# EAGLE design X16-ESC-Controller (EAGLE 9.6.2)
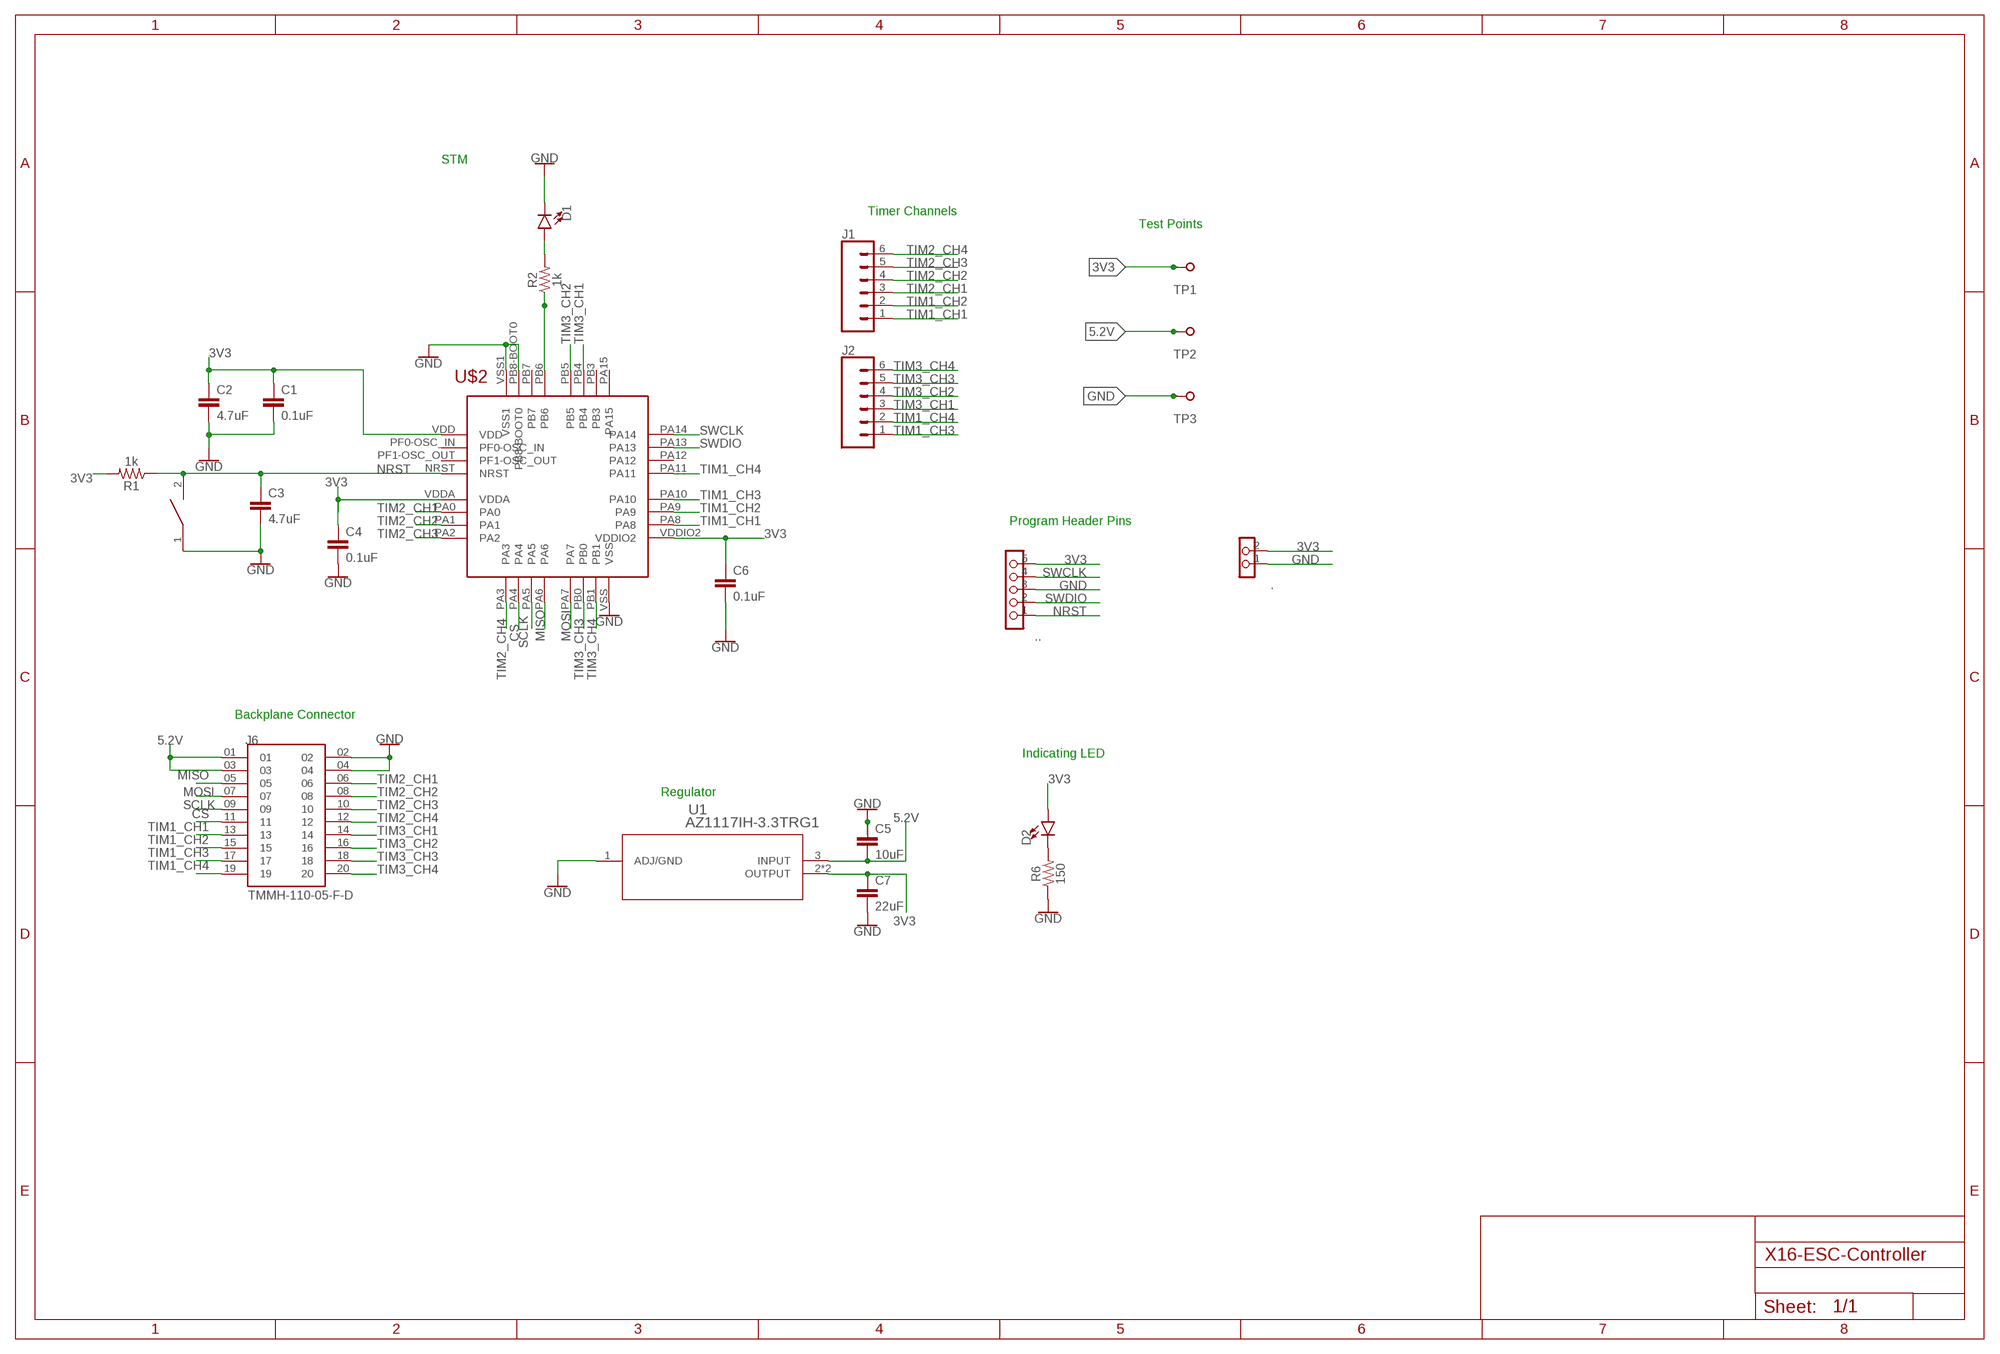
[diagram p0: schematic, sheet 1]

## Parts
.  TEST_PIN-1X2  [1X02]
..  TEST_PIN-1X5  [1X05]
C1  0.1uF  4.7PF-0603-50V-5%  [0603]
C2  4.7uF  4.7PF-0603-50V-5%  [0603]
C3  4.7uF  4.7PF-0603-50V-5%  [0603]
C4  0.1uF  4.7PF-0603-50V-5%  [0603]
C5  10uF  4.7PF-0603-50V-5%  [0603]
C6  0.1uF  4.7PF-0603-50V-5%  [0603]
C7  22uF  4.7PF-0603-50V-5%  [0603]
D1  Green  LED-GREEN0805-PG  [LED-0805]
D2  Green  LED-GREEN0805-PG  [LED-0805]
J1  CONN_06NO_SILK_NO_POP  [1X06_NO_SILK]
J2  CONN_06NO_SILK_NO_POP  [1X06_NO_SILK]
J6  TMMH-110-05-F-D  [SAMTEC_TMMH-110-05-F-D]
R1  1k  2.55KOHM-0603-1/10W-1%  [0603]
R2  1k  2.55KOHM-0603-1/10W-1%  [0603]
R6  150  2.55KOHM-0603-1/10W-1%  [0603]
TP1  TESTPOINT_5.04MM  [TESTPOINT_5.04MM]
TP2  TESTPOINT_5.04MM  [TESTPOINT_5.04MM]
TP3  TESTPOINT_5.04MM  [TESTPOINT_5.04MM]
U1  AZ1117IH-3.3TRG1  [SOT223_AZ1117I_6P5X3P5_DIO]
U$2  IC_STM32F042K6T6  [STM32F042K6T6]
U$3  SWITCH_DISCRETECOMPONENTS  [DISCRETECOMPONENTS_SW_2512]

## Nets
3V3: ..2 ...5 C1.1 C2.1 C4.1 C6.1 C7.1 D2.A R1.2 TP1.TP U1.2(OUTPUT) U1.4(OUTPUT) U$2.VDD U$2.VDDA U$2.VDDIO2
5.2V: C5.2 J6.01 J6.03 TP2.TP U1.3(INPUT)
CS: J6.11 U$2.PA4
GND: ..1 ...3 C1.2 C2.2 C3.2 C4.2 C5.1 C6.2 C7.2 D1.C J6.02 J6.04 R6.1 TP3.TP U1.1(ADJ/GND) U$2.PB8-BOOT0 U$2.VSS U$2.VSS1 U$3.1
MISO: J6.05 U$2.PA6
MOSI: J6.07 U$2.PA7
N$1: D2.C R6.2
N$3: R2.1 U$2.PB6
N$7: D1.A R2.2
NRST: ...1 C3.1 R1.1 U$2.NRST U$3.2
SCLK: J6.09 U$2.PA5
SWCLK: ...4 U$2.PA14
SWDIO: ...2 U$2.PA13
TIM1_CH1: J1.1 J6.13 U$2.PA8
TIM1_CH2: J1.2 J6.15 U$2.PA9
TIM1_CH3: J2.1 J6.17 U$2.PA10
TIM1_CH4: J2.2 J6.19 U$2.PA11
TIM2_CH1: J1.3 J6.06 U$2.PA0
TIM2_CH2: J1.4 J6.08 U$2.PA1
TIM2_CH3: J1.5 J6.10 U$2.PA2
TIM2_CH4: J1.6 J6.12 U$2.PA3
TIM3_CH1: J2.3 J6.14 U$2.PB4
TIM3_CH2: J2.4 J6.16 U$2.PB5
TIM3_CH3: J2.5 J6.18 U$2.PB0
TIM3_CH4: J2.6 J6.20 U$2.PB1
Unconnected: U$2.PA12 U$2.PA15 U$2.PB3 U$2.PB7 U$2.PF0-OSC_IN U$2.PF1-OSC_OUT

## Notes on the sheet
- STM
- Timer Channels
- Test Points
- Program Header Pins
- Backplane Connector
- Indicating LED
- Regulator

## Library data of the parts
. = X16-ExtraComponents:TEST_PIN-1X2: PIN HEADER
.. = X16-ExtraComponents:TEST_PIN-1X5: PIN HEADER
C1-C7 = SparkFun-Capacitors:4.7PF: 4.7pF ceramic capacitors A capacitor is a passive two-terminal electrical component used to store electrical energy temporarily in an electric field.; PROD_ID: CAP-07880; VALUE: 4.7pF
D1 D2 = SparkFun-LED:LED-GREEN: Green SMD LED Used in manufacturing of various products at SparkFun Packages: 0603 - SMD 0603 package [Product Link] <http://www.futureelectronics.com/en/technologies/semiconductors/optoelectronics/leds/Pages/9894312-LTST-C190GKT.aspx?CrossPart=HSMG-C190&IM=0> LilyPad 1206 - SMD1206 LilyPad package [Product Link] <http://www.futureelectronics.com/en/Technologies/Product.aspx?ProductID=IN150NGHARVATEKCORPORATION2049943&IM=0> 1206 - SMD1206 package [Product Link] <http://www.futureelectronics.com/en/technologies/semiconductors/optoelectronics/leds/Pages/8315665-LTST-C150KGKT.aspx?IM=0> 1206 Bottom Mount -SMD 1206 Bottom Mount [Product Link] <http://www.digikey.com/product-detail/en/lite-on-inc/LTST-C230KGKT/160-1456-1-ND/386854> SparkFun Products: Pro Mini 328 -5V <https://www.sparkfun.com/products/821> RedBoard <https://www.sparkfun.com/products/12757> MP3 Trigger <https://www.sparkfun.com/products/13720> Makey Makey <https://www.sparkfun.com/products/11076>
J1 J2 = SparkFun-Connectors:CONN_06: Multi connection point. Often used as Generic Header-pin footprint for 0.1 inch spaced/style header connections On any of the 0.1 inch spaced packages, you can populate with these: Break Away Headers - Straight <https://www.sparkfun.com/products/116> (PRT-00116) Break Away Male Headers - Right Angle <https://www.sparkfun.com/products/553> (PRT-00553) Female Headers <https://www.sparkfun.com/products/115> (PRT-00115) Break Away Headers - Machine Pin <https://www.sparkfun.com/products/117> (PRT-00117) Break Away Female Headers - Swiss Machine Pin <https://www.sparkfun.com/products/743> (PRT-00743) Arduino Stackable Header - 6 Pin <https://www.sparkfun.com/products/9280> (PRT-09280) Screw Terminals 2.54mm Pitch (6-Pin) <https://www.sparkfun.com/products/16499> (PRT-16499) For SCREWTERMINALS and SPRING TERMINALS visit here: Screw Terimnals on SparkFun.com <https://www.sparkfun.com/search/results?term=Screw+Terminals> (5mm/3.5mm/2.54mm spacing) This device is also useful as a general connection point to wire up your design to another part of your project. Our various solder wires solder well into these plated through hole pads. Hook-Up Wire - Assortment (Stranded, 22 AWG) <https://www.sparkfun.com/products/11375> (PRT-11375) Hook-Up Wire - Assortment (Solid Core, 22 AWG) <https://www.sparkfun.com/products/11367> (PRT-11367) View the entire wire category on our website here <https://www.sparkfun.com/categories/141>
J6 = TMMH-110-05-F-D:TMMH-110-05-F-D; MANUFACTURER: Samtec; PARTREV: R; STANDARD: Manufacturer Recommendations
R1 R2 R6 = SparkFun-Resistors:2.55KOHM: 2.55kΩ resistor A resistor is a passive two-terminal electrical component that implements electrical resistance as a circuit element. Resistors act to reduce current flow, and, at the same time, act to lower voltage levels within circuits. - Wikipedia; PROD_ID: RES-11227; VALUE: 2.55k
TP1-TP3 = X16-ExtraComponents:TESTPOINT_5.04MM: TEST PIN
U1 = X16-ESC-Controller:AZ1117IH-3.3TRG1; COPYRIGHT: Copyright (C) 2023 Ultra Librarian. All rights reserved.; MANUFACTURER_PART_NUMBER: AZ1117IH-3.3TRG1; MFR_NAME: Diodes Inc
U$2 = X16-ESC-Controller:IC_STM32F042K6T6
U$3 = X16-ESC-Controller:SWITCH_DISCRETECOMPONENTS: TE Connectivity FSM2JMTR Switch

## Board
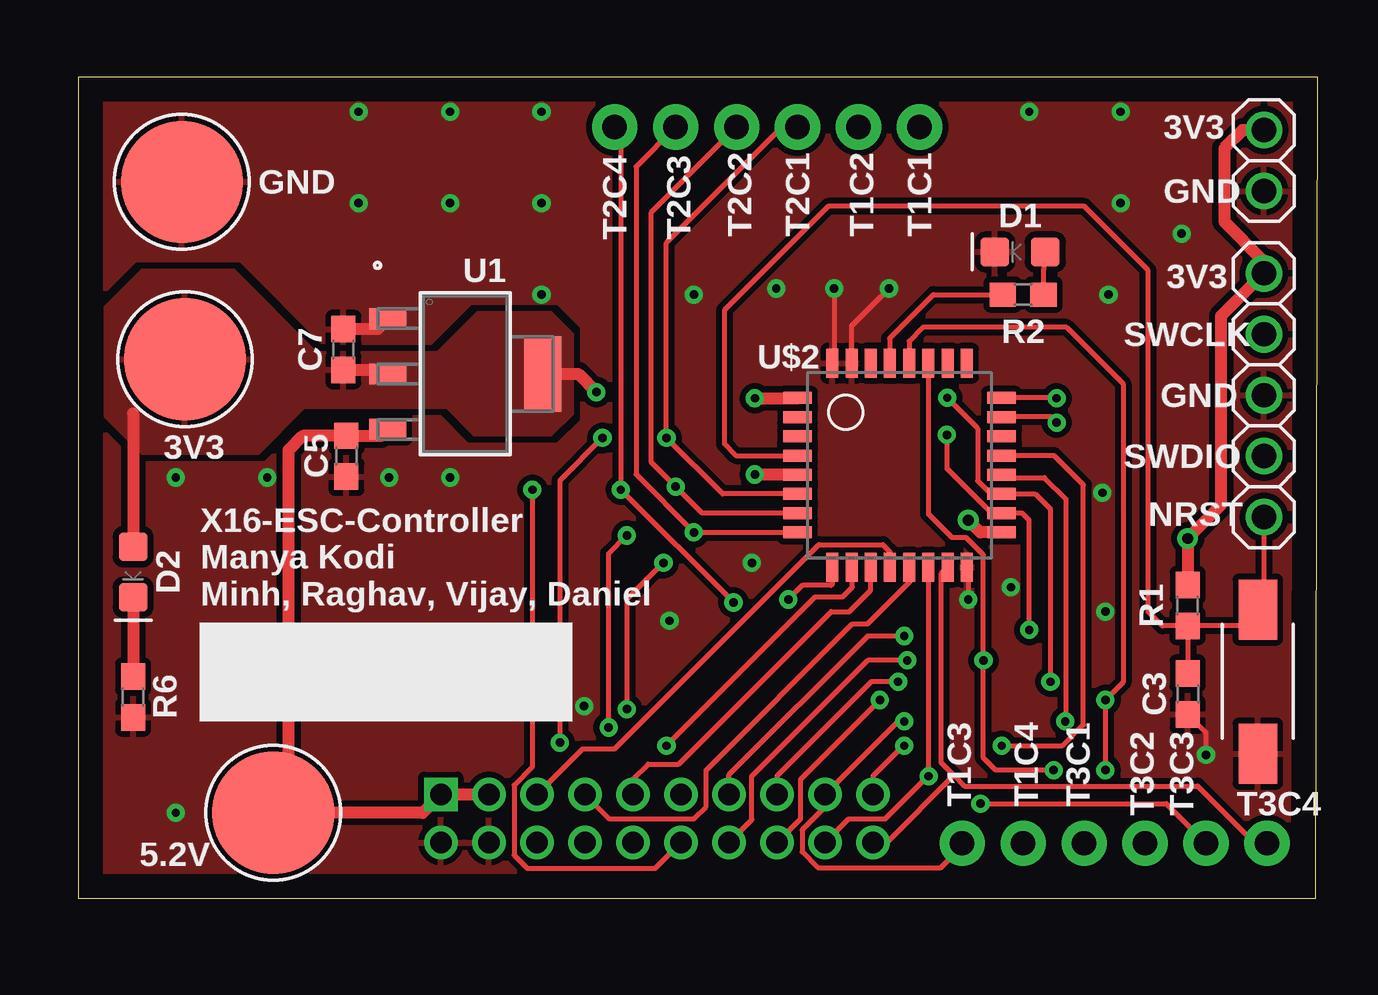
[diagram p1: board, top side]
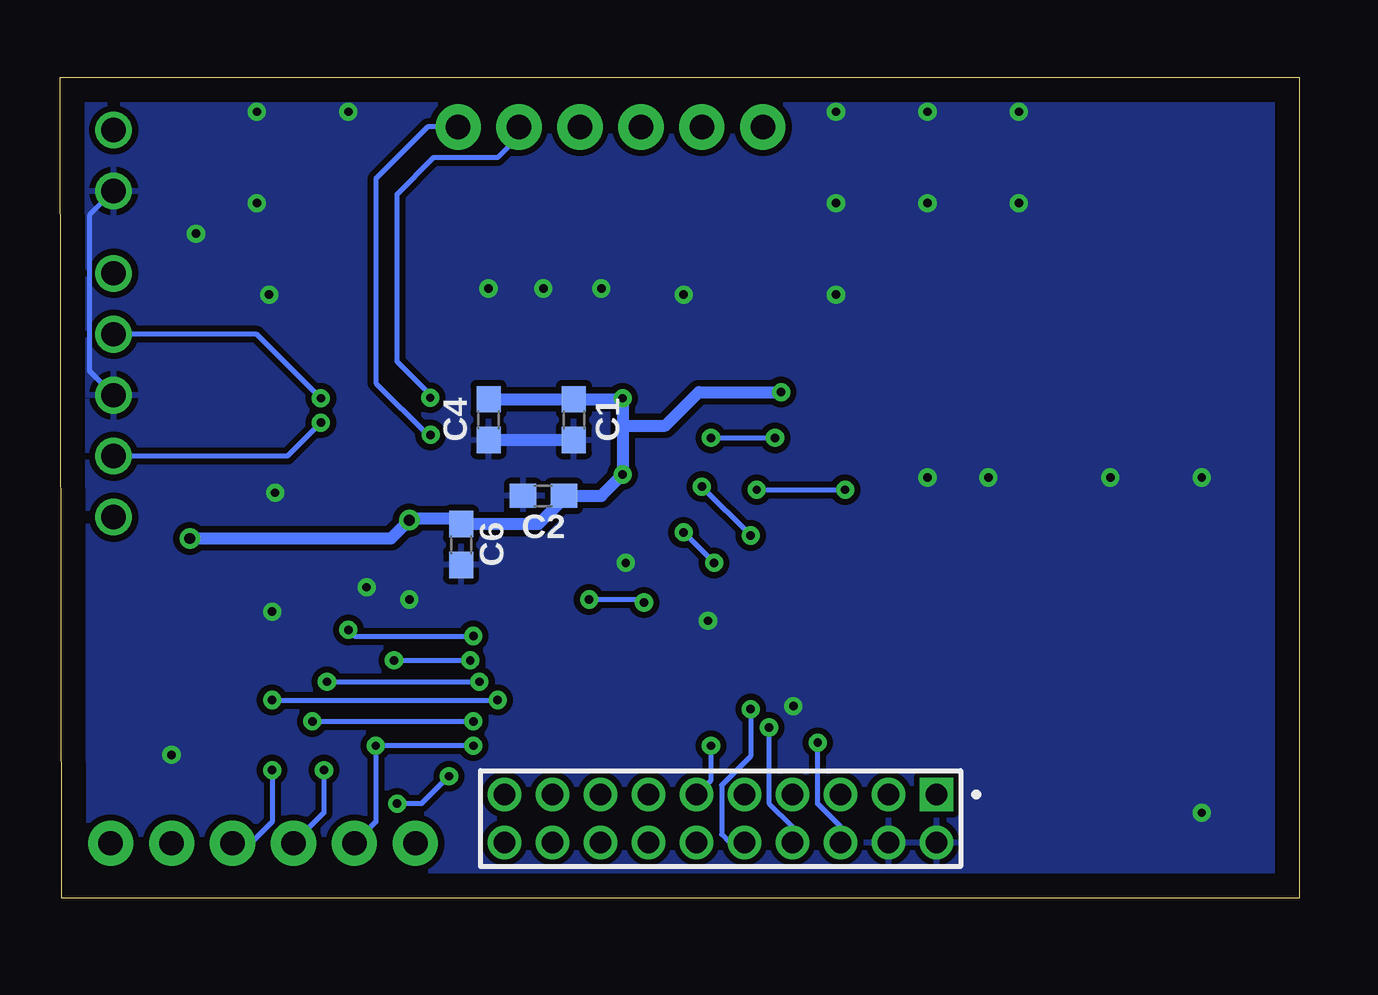
[diagram p2: board, bottom side, seen from below]

Size 51.64 x 34.21 mm. Coordinates in mm from the lower left corner, seen from the top.
Outline: 0,0 51.56,0 51.64,34.21 0,34.21 0,0
Copper layers (1*16): Top 0.035mm / dielectric 1.5mm / Bottom 0.035mm
Design rules "477": minimum track width 6mil, minimum drill 0.35mm, track to track 6mil, track to pad 6mil, pad to pad 6mil, via to via 6mil, smd to smd 6mil, copper to edge 40mil, drill to drill 6mil, minimum pad ring 10mil, minimum via ring 8mil, stop-mask expansion 4mil, vias tented up to drill 0mil, thermal gap 10mil

### Footprints (pad centres in the part's own frame; a part is rotated, then mirrored left to right if it is on the bottom)
1X02 = drill 1.016: 1 -1.27,0; 2 1.27,0
1X05 = drill 1.016: 1 -5.08,0; 2 -2.54,0; 3 0,0; 4 2.54,0; 5 5.08,0
0603 = smd 1.1 x 1: 1 -0.85,0; 2 0.85,0
LED-0805 = smd 1.2 x 1.2: A -1.05,0; C 1.05,0
1X06_NO_SILK = drill 1.016 pad 1.88: 1 0,0; 2 2.54,0; 3 5.08,0; 4 7.62,0; 5 10.16,0; 6 12.7,0
SAMTEC_TMMH-110-05-F-D = drill 0.889 pad 1.239 square: 01 0,0 | drill 0.889 pad 1.239: 02 0,2; 03 2,0; 04 2,2; 05 4,0; 06 4,2; 07 6,0; 08 6,2; 09 8,0; 10 8,2; 11 10,0; 12 10,2; 13 12,0; 14 12,2; 15 14,0; 16 14,2; 17 16,0; 18 16,2; 19 18,0; 20 18,2
TESTPOINT_5.04MM = smd 5.08 x 5.08: TP 0,0
SOT223_AZ1117I_6P5X3P5_DIO = smd 0.864 x 1.549: 1 -2.3,-3.226; 2 0,-3.226; 3 2.3,-3.226 | smd 3.15 x 1.549: 4 0,3.226
STM32F042K6T6 = smd 1.2 x 0.5: NRST 0,3.2; PA0 0,1.6; PA1 0,0.8; PA2 0,0; PA8 8.5,0.8; PA9 8.5,1.6; PA10 8.5,2.4; PA11 8.5,3.2; PA12 8.5,4; PA13 8.5,4.8; PA14 8.5,5.6; PF0-OSC_IN 0,4.8; PF1-OSC_OUT 0,4; VDD 0,5.6; VDDA 0,2.4; VDDIO2 8.5,0 | smd 0.5 x 1.2: PA3 1.45,-1.45; PA4 2.25,-1.45; PA5 3.05,-1.45; PA6 3.85,-1.45; PA7 4.65,-1.45; PA15 7.05,7.05; PB0 5.45,-1.45; PB1 6.25,-1.45; PB3 6.25,7.05; PB4 5.45,7.05; PB5 4.65,7.05; PB6 3.85,7.05; PB7 3.05,7.05; PB8-BOOT0 2.25,7.05; VSS 7.05,-1.45; VSS1 1.45,7.05
DISCRETECOMPONENTS_SW_2512 = smd 2.5 x 1.6: 1 -3,0; 2 3,0

### Placement (x,y rotation side)
.  49.4,30.73 90 top
..  49.4,20.95 90 top
C1  30.23,19.94 270 bottom
C2  31.5,16.76 180 bottom
C3  46.23,8.51 270 top
C4  33.78,19.94 270 bottom
C5  11.18,18.41 90 top
C6  34.92,14.73 270 bottom
C7  11.05,22.86 90 top
D1  39.24,26.92 180 top
D2  2.29,13.59 270 top
J1  35.05,32.13 180 top
J2  36.83,2.29 0 top
J6  15.11,4.32 180 bottom
R1  46.23,12.19 90 top
R2  39.37,25.15 0 top
R6  2.29,8.38 90 top
TP1  4.45,22.45 0 top
TP2  8.13,3.56 0 top
TP3  4.32,29.84 0 top
U1  16.13,21.84 270 top
U$2  29.97,15.24 0 top
U$3  49.15,9.02 90 top

### Tracks (layer width: path | path; a pad name or v marks a point on that pad's centre or on a via)
3V3  (via drill 0.35, 0.45)
  Top 0.508: U$2.VDD 29.96,20.83 v28.19,20.83 | U$2.VDDA 29.96,17.65 v28.19,17.65 | U$2.VDDIO2 37.59,15.24 v37.08,15.75 | R1.2 v46.23,14.99 47.62,16.38 47.62,24.26 ...5 49.4,26.54 47.75,28.19 47.75,31.24 48.51,32 ..2 | R1.2 | C7.1 12.74,22.01 U1.2 | U1.4 20.83,21.84 v21.59,21.08 | 2.29,20.19 D2.A
  Bottom 0.152: 28.23,20.79 v28.19,20.83 | C2.1 30.65,16.64
  Bottom 0.508: C4.1 C1.1 28.23,20.79 | v46.23,14.99 37.85,14.99 v37.08,15.75 37,15.84 35.18,15.84 C6.1 31.7,15.58 30.65,16.64 | C2.1 29.08,16.76 v28.19,17.65 28.19,19.68 | v28.19,20.83 28.19,19.68 | 28.19,19.68 26.42,19.68 25.02,21.08 v21.59,21.08
  pour Top (isolate 0.203): 9.91,22.73 14.99,22.73 16.64,24.38 19.69,24.38 20.57,23.49 20.57,20.19 19.69,19.3 16.51,19.3 15.37,20.45 9.4,20.45 7.49,18.54 2.67,18.54 1.02,20.19 1.02,24.51 2.67,26.16 6.48,26.16
5.2V
  Top 0.508: U1.3 12.62,19.26 C5.2 9.36,19.26 8.76,18.67 8.76,4.19 TP2.TP 14.35,3.56 J6.01 J6.03
CS  (via drill 0.35)
  Top 0.203: v24.51,6.35 30.71,12.55 31.85,12.55 32.26,12.95 32.26,13.75 U$2.PA4
  Bottom 0.203: J6.11 24.51,4.92 v24.51,6.35
GND  (via drill 0.35)
  Top 0.203: U$2.VSS 37.08,13.73 v37.08,12.45 | C3.2 46.99,6.9 v46.99,5.97 | v31.5,25.4 31.5,22.36 U$2.VSS1 | U$2.PB8-BOOT0 32.22,23.84 v33.78,25.4
  Top 0.508: U1.1 12.47,23.71 C7.2
  Bottom 0.203: ..1 50.42,28.45 50.42,21.97 ...3
  Bottom 0.508: C1.2 C4.2
  other vias: 29.08,25.4 42.67,16.89 42.8,11.94 21.08,8 38.86,12.95 24.64,11.56 42.93,25.15 28.07,13.97 11.68,32.77 15.49,32.77 19.3,32.77 19.3,28.96 15.49,28.96 11.68,28.96 19.3,25.15 4.06,17.53 7.87,17.53 4.06,3.56 25.65,25.15 39.62,32.77 43.43,32.77 43.43,28.96 45.97,27.69 12.95,17.53 15.49,17.53
  pour Top (isolate 0.254, rank 6): -1.4,36.07 53.72,36.07 53.85,35.94 53.85,-1.65 -1.65,-1.65 -1.65,35.81
  pour Bottom (isolate 0.254, rank 6): 53.72,35.94 -1.4,35.94 -1.52,35.81 -1.52,-1.78 53.97,-1.78 53.97,35.69
MISO
  Top 0.203: J6.05 21.02,6.22 22.35,6.22 30.86,14.73 33.53,14.73 33.82,14.44 U$2.PA6
MOSI
  Top 0.152: 34.67,13.74 U$2.PA7
  Top 0.203: J6.07 22.13,3.3 25.65,3.3 26.16,3.81 26.16,4.71 26.16,5.33 32.26,11.43 32.89,11.43 34.67,13.21 34.67,13.74
N$1
  Top 0.508: D2.C R6.2
N$3
  Top 0.203: U$2.PB6 33.81,22.3 33.81,23.32 35.63,25.15 R2.1
N$7
  Top 0.203: R2.2 40.22,26.18 D1.A
NRST
  Top 0.203: ...1 49.4,12.27 U$3.2 48.47,11.34 R1.1 | R1.1 C3.1 | U$2.NRST 27.41,18.44 26.92,18.92 26.92,24.49 31.25,28.82 41.92,28.82 44.58,26.16 44.58,11.94 45.17,11.34 R1.1
SCLK
  Top 0.203: U$2.PA5 33.02,12.83 32.13,11.94 31.37,11.94 25.02,5.59 23.75,5.59 23.11,4.95 J6.09
SWCLK  (via drill 0.35)
  Top 0.203: v40.77,20.83 40.75,20.84 U$2.PA14
  Bottom 0.203: v40.77,20.83 43.43,23.49 ...4
SWDIO  (via drill 0.35)
  Top 0.203: v40.77,19.81 40.51,20.07 38.5,20.07 U$2.PA13
  Bottom 0.203: v40.77,19.81 42.17,18.41 ...2
TIM1_CH1  (via drill 0.35)
  Top 0.203: v36.2,19.3 36.2,17.91 38.06,16.04 U$2.PA8 39.33,16.04 39.62,15.75 v39.62,11.18 | v34.42,10.92 32.89,10.92 27.11,5.14 J6.13
  Bottom 0.203: J1.1 36.32,32.13 38.48,29.97 38.48,21.46 36.32,19.3 v36.2,19.3 | v39.62,11.18 39.37,10.92 v34.42,10.92
TIM1_CH2  (via drill 0.35)
  Top 0.203: v36.21,20.85 37.48,19.58 37.48,17.39 38.03,16.84 U$2.PA9 39.87,16.84 40.51,16.2 v40.51,9.02 | v34.16,9.02 33.05,9.02 29.11,5.08 J6.15
  Bottom 0.203: v36.21,20.85 36.21,20.97 37.59,22.35 37.59,29.34 36.07,30.86 33.4,30.86 32.51,31.75 J1.2 | v40.51,9.02 v34.16,9.02
TIM1_CH3  (via drill 0.35)
  Top 0.203: U$2.PA10 38.59,17.53 40.26,17.53 41.15,16.64 41.15,7.39 v41.12,7.37 | v34.42,7.37 34.16,7.37 J6.17 31.11,3.79 30.16,2.84 30.16,1.92 30.81,1.27 35.94,1.27 36.83,2.16 J2.1
  Bottom 0.203: v41.12,7.37 v34.42,7.37
TIM1_CH4  (via drill 0.35)
  Top 0.203: U$2.PA11 40.66,18.44 41.88,17.21 41.88,7.22 41.02,6.35 v38.48,6.35 | v34.42,6.35 34.38,6.35 33.11,5.08 J6.19
  Bottom 0.203: v34.42,6.35 v38.48,6.35 38.48,3.17 J2.2
TIM2_CH1  (via drill 0.35)
  Top 0.203: U$2.PA0 26.85,16.84 v24.51,19.18 24.51,27.3 29.34,32.13 J1.3 | v21.84,19.18 20.07,17.4 v20.07,6.48
  Bottom 0.203: v24.51,19.18 v21.84,19.18 | J6.06 19.11,2.97 20.07,3.92 v20.07,6.48
TIM2_CH2  (via drill 0.35)
  Top 0.203: U$2.PA1 26,16.04 v24.89,17.14 23.88,18.16 23.88,28.57 J1.4 | v22.86,15.11 22.1,14.35 v22.1,7.11
  Bottom 0.203: J6.08 21.11,2.97 22.1,3.96 v22.1,7.11 | v24.89,17.14 v22.86,15.11
TIM2_CH3  (via drill 0.35)
  Top 0.203: J1.5 23.24,30.48 23.24,17.65 v25.65,15.24 U$2.PA2 | v24.38,13.97 22.86,12.45 v22.86,7.87
  Bottom 0.203: J6.10 23.73,2.32 24.07,2.65 24.07,4.71 22.86,5.92 v22.86,7.87 | v25.65,15.24 v24.38,13.97
TIM2_CH4  (via drill 0.35)
  Top 0.203: U$2.PA3 31.42,13.08 31.37,13.03 30.18,13.03 v29.59,12.45 | v27.3,12.32 v22.61,17.02 22.61,31.75 22.35,32 J1.6 | v18.92,17.02 18.92,5.47 18.16,4.71 18.16,1.8 18.72,1.24 24.03,1.24 J6.12
  Bottom 0.203: v29.59,12.45 27.43,12.45 v27.3,12.32 | v22.61,17.02 v18.92,17.02
TIM3_CH1  (via drill 0.35)
  Top 0.203: U$2.PB4 35.42,16.01 36.41,15.03 37,15.03 37.72,14.3 v37.72,9.91 37.72,5.84 38.23,5.33 v40.64,5.33 | J6.14 28.07,3.27 28.07,5.08 32.89,9.91 v34.54,9.91
  Bottom 0.203: v37.72,9.91 v34.54,9.91 | v40.64,5.33 40.64,3.56 J2.3
TIM3_CH2  (via drill 0.35)
  Top 0.203: U$2.PB5 34.62,23.21 35.19,23.78 41.19,23.78 43.54,21.43 43.54,8.99 v42.8,8.26 v42.8,5.33 | J6.16 30.1,3.3 30.1,4.95 v33.4,8.26
  Bottom 0.203: v42.8,8.26 v33.4,8.26 | J2.4 43.69,2.29 42.8,3.17 v42.8,5.33
TIM3_CH3  (via drill 0.35)
  Top 0.203: J2.5 45.34,3.94 v37.59,3.94 | U$2.PB0 35.42,5.09 | 35.42,5.09 v35.43,5.08 | J6.18 32.1,3.3 33.63,3.3 35.42,5.09
  Bottom 0.203: v37.59,3.94 36.58,3.94 v35.43,5.08
TIM3_CH4
  Top 0.203: U$2.PB1 35.94,13.51 35.94,5.65 36.48,5.11 | J2.6 49.02,2.29 46.64,4.67 36.93,4.67 36.48,5.11 | J6.20 33.69,2.32 36.48,5.11

### Text on the board
tPlace: T2C4 | T2C3 | T2C2 | T2C1 | T1C2 | T1C1 | U$2
tNames: 3V3 | GND | GND | 3V3 | SWCLK | GND | 3V3 | SWDIO | NRST | X16-ESC-Controller / Manya Kodi / Minh, Raghav, Vijay, Daniel | T1C3 | T1C4 | T3C1 | T3C2 | T3C3 | T3C4 | 5.2V